# Altium schematic sheet Kivipallur_joonis4.SchDoc
size A4; SheetNumber: 1; SheetTotal: 4
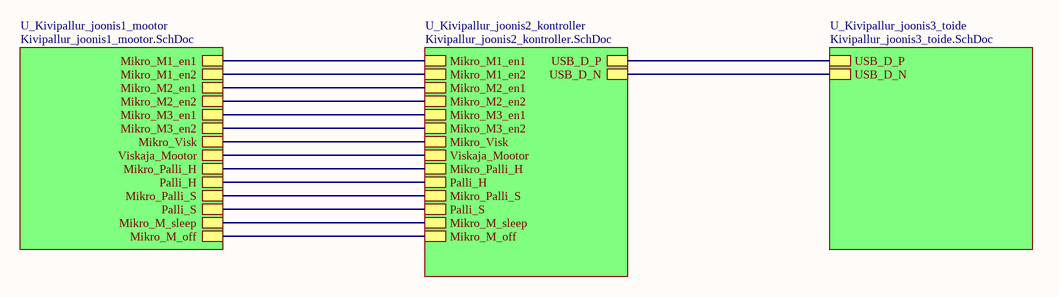
[diagram p0: Kivipallur_joonis4.SchDoc]

## Sub-sheets
U_Kivipallur_joonis1_mootor = Kivipallur_joonis1_mootor.SchDoc: Mikro_M1_en1, Mikro_M1_en2, Mikro_M2_en1, Mikro_M2_en2, Mikro_M3_en1, Mikro_M3_en2, Mikro_M_sleep, Mikro_M_off, Mikro_Visk, Mikro_Palli_S, Mikro_Palli_H, Viskaja_Mootor, Palli_S, Palli_H
U_Kivipallur_joonis2_kontroller = Kivipallur_joonis2_kontroller.SchDoc: Mikro_M_sleep, Mikro_Visk, Mikro_M3_en2, Mikro_M3_en1, Mikro_M2_en2, Mikro_M2_en1, Mikro_M1_en2, Mikro_M1_en1, Mikro_M_off, USB_D_P, USB_D_N, Viskaja_Mootor, Palli_H, Palli_S, Mikro_Palli_H, Mikro_Palli_S
U_Kivipallur_joonis3_toide = Kivipallur_joonis3_toide.SchDoc: USB_D_P, USB_D_N

## Nets
(unnamed): sheet U_Kivipallur_joonis1_mootor/Mikro_M1_en1, sheet U_Kivipallur_joonis2_kontroller/Mikro_M1_en1
(unnamed): sheet U_Kivipallur_joonis1_mootor/Mikro_M1_en2, sheet U_Kivipallur_joonis2_kontroller/Mikro_M1_en2
(unnamed): sheet U_Kivipallur_joonis1_mootor/Mikro_M2_en1, sheet U_Kivipallur_joonis2_kontroller/Mikro_M2_en1
(unnamed): sheet U_Kivipallur_joonis1_mootor/Mikro_M2_en2, sheet U_Kivipallur_joonis2_kontroller/Mikro_M2_en2
(unnamed): sheet U_Kivipallur_joonis1_mootor/Mikro_M3_en1, sheet U_Kivipallur_joonis2_kontroller/Mikro_M3_en1
(unnamed): sheet U_Kivipallur_joonis1_mootor/Mikro_M3_en2, sheet U_Kivipallur_joonis2_kontroller/Mikro_M3_en2
(unnamed): sheet U_Kivipallur_joonis1_mootor/Mikro_M_sleep, sheet U_Kivipallur_joonis2_kontroller/Mikro_M_sleep
(unnamed): sheet U_Kivipallur_joonis1_mootor/Mikro_M_off, sheet U_Kivipallur_joonis2_kontroller/Mikro_M_off
(unnamed): sheet U_Kivipallur_joonis1_mootor/Mikro_Visk, sheet U_Kivipallur_joonis2_kontroller/Mikro_Visk
(unnamed): sheet U_Kivipallur_joonis1_mootor/Mikro_Palli_S, sheet U_Kivipallur_joonis2_kontroller/Mikro_Palli_S
(unnamed): sheet U_Kivipallur_joonis1_mootor/Mikro_Palli_H, sheet U_Kivipallur_joonis2_kontroller/Mikro_Palli_H
(unnamed): sheet U_Kivipallur_joonis1_mootor/Viskaja_Mootor, sheet U_Kivipallur_joonis2_kontroller/Viskaja_Mootor
(unnamed): sheet U_Kivipallur_joonis1_mootor/Palli_S, sheet U_Kivipallur_joonis2_kontroller/Palli_S
(unnamed): sheet U_Kivipallur_joonis1_mootor/Palli_H, sheet U_Kivipallur_joonis2_kontroller/Palli_H
(unnamed): sheet U_Kivipallur_joonis2_kontroller/USB_D_P, sheet U_Kivipallur_joonis3_toide/USB_D_P
(unnamed): sheet U_Kivipallur_joonis2_kontroller/USB_D_N, sheet U_Kivipallur_joonis3_toide/USB_D_N